# Altium schematic sheet RF_Block.SchDoc
size A4; SheetNumber: 3; SheetTotal: 9
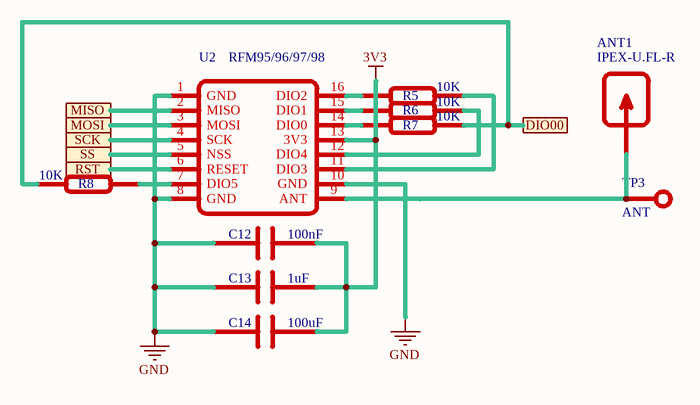
[diagram p0: RF_Block.SchDoc]

## Parts
ANT1  IPEX-U.FL-R  [IPEX Connector SMD]
C12  100nF  [C0805]
C13  1uF  [C0805]
C14  100uF  [C0805]
R5  10K  [R0805]
R6  10K  [R0805]
R7  10K  [R0603]
R8  10K  [R0603]
TP3  ANT  [Test Point]
U2  RFM95/96/97/98  [LORA RFM95/96/97/98W]

## Ports
DIO00, MISO, MOSI, RST, SCK, SS

## Nets
3V3: C12.2 C13.2 C14.2 U2.13(3V3)
GND: C12.1 C13.1 C14.1 U2.1(GND) U2.8(GND) U2.10(GND)
DIO00: R7.2 R8.1 ; port DIO00
MISO: U2.2(MISO) ; port MISO
MOSI: U2.3(MOSI) ; port MOSI
RST: U2.6(RESET) ; port RST
SCK: U2.4(SCK) ; port SCK
SS: U2.5(NSS) ; port SS
NetANT1_1: ANT1.1 TP3.1 U2.9(ANT)
NetR5_1: R5.1 U2.16(DIO2)
NetR5_2: R5.2 U2.11(DIO3)
NetR6_1: R6.1 U2.15(DIO1)
NetR6_2: R6.2 U2.12(DIO4)
NetR7_1: R7.1 U2.14(DIO0)
NetR8_2: R8.2 U2.7(DIO5)

Not connected (* = marked no-connect by the designer): ANT1 2(GND)

## Notes on the sheet
- Title
- Size:
- Date:
- A4
- Number:
- Time:
- Revision:
- Design by:
- Company:
- File:

## Library data of the parts
ANT1 = IPEX-U.FL-R: RF Antena; ComponentLink1Description: Datasheets; ComponentLink1URL: https://cdn.taoglas.com/datasheets/RECE.20279.001E.01.pdf
C12-C14 = CAP-CER: Ceramic Capacitor
R5-R8 = Resistor
TP3 = TestPoint: Test Point
U2 = RFM95/96/97/98 LORA Module: The RFM95/96/97/98(W) transceivers feature the LoRaTM    long range modem that provides ultra-long range spread spectrum communication and high interference immunity whilst minimising current consumption.; ComponentLink1Description: RFM95/96/97/98; ComponentLink1URL: https://cdn.sparkfun.com/assets/learn_tutorials/8/0/4/RFM95_96_97_98W.pdf